# Altium project lab1.PrjPcb
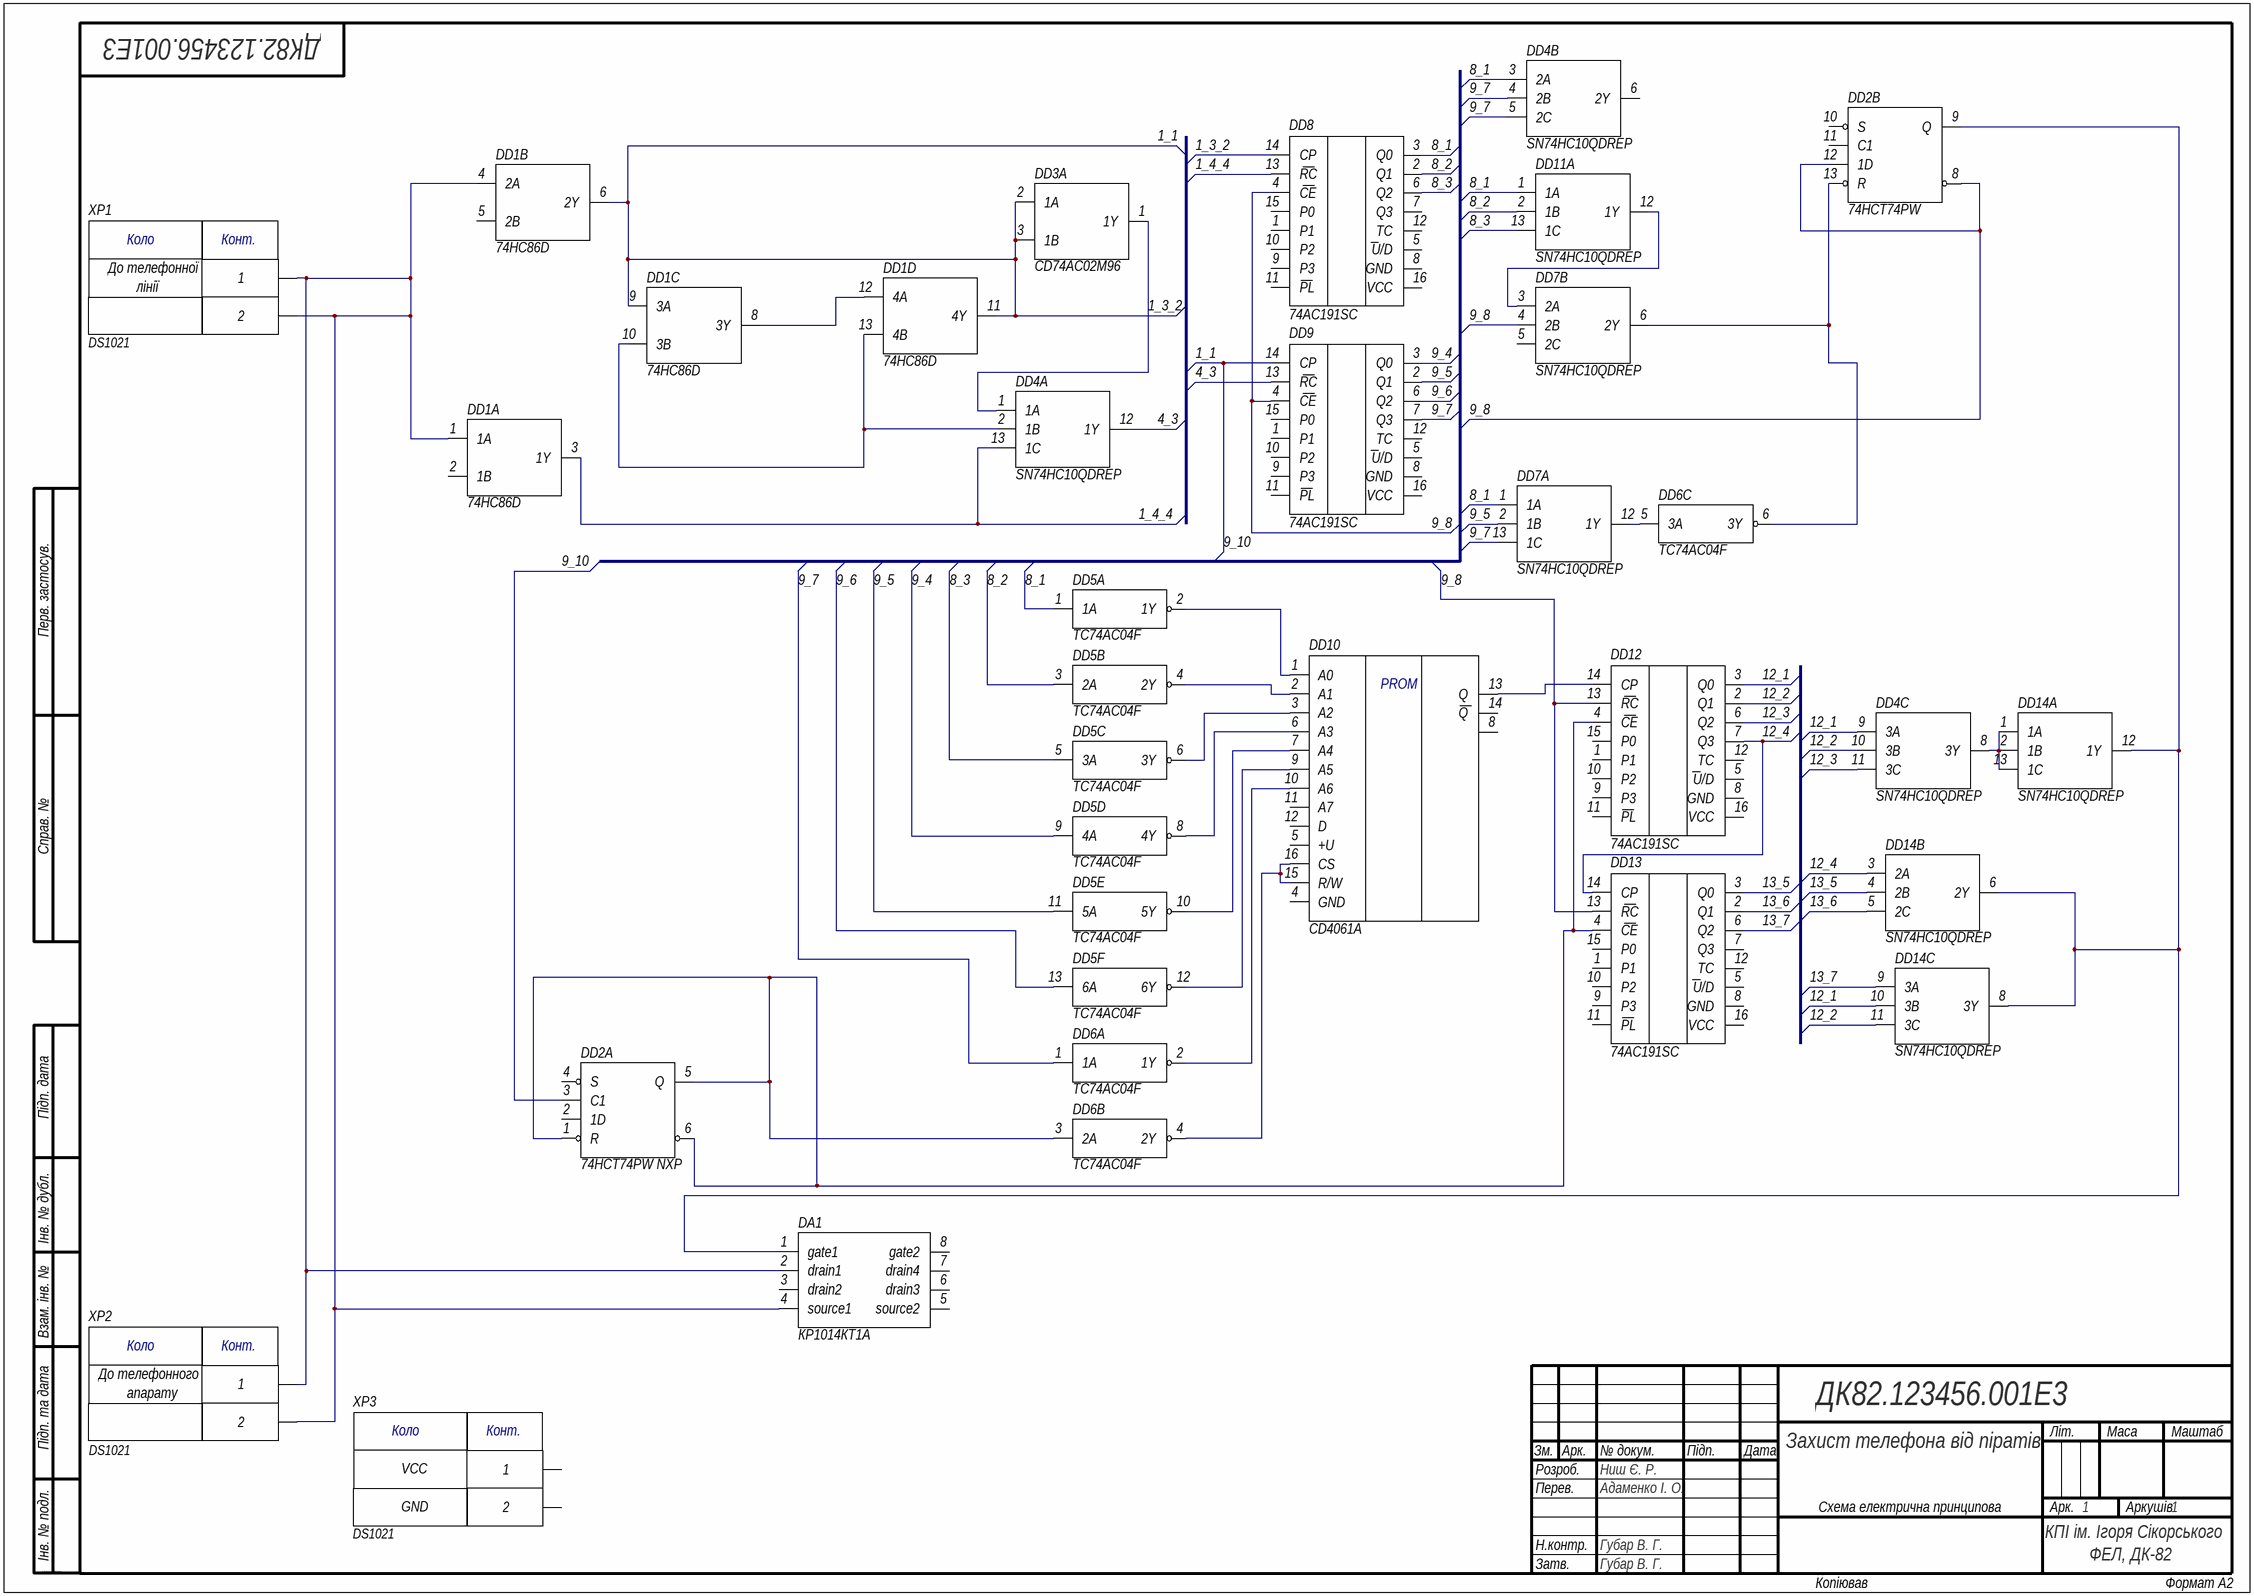
[diagram p0: s1mple.SchDoc]
Вид_документа_SCH: Схема електрична принципова; Код_документа_SCH: Э3; Наименование: Захист телефона від піратів; Наименование1: Захист телефона від піратів; Обозначение: ДК82.123456.001; Обозначение_Код: ДК82.123456.001Е3; Проект: ДК82.123456.001ЕЗ; Формат_PCB: А3; п_Н_контр_Р: Губар В. Г.; п_Пров_Р: Адаменко І. О.; п_Разраб_Р: Ниш Є. Р.; п_Утв_Р: Губар В. Г.
1 sheet, 18 parts. Net scope: global (net labels, ports and power ports of the same name join across sheets).
Board file: PCB1.PcbDoc

## Sheet s1mple.SchDoc
size 594 x 420 mm; Organization: ФЕЛ, ДК-82; DocumentNumber: 1; SheetNumber: 1; SheetTotal: 1

### Parts
DA1  КР1014КТ1А Электроника и связь  [DIP8]  (value not drawn)
DD1  74HC86D Philips  [SOIC-14]  (value not drawn)  (parts A,B,C,D of 5)
DD2  74HCT74PW NXP  [TSSOP-14]  (parts A,B of 3)
DD3  CD74AC02M96 TI  [SOIC-14]  (value not drawn)  (part A of 5)
DD4  SN74HC10QDREP Texas Instruments  [SOIC-14]  (value not drawn)  (parts A,B,C of 4)
DD5  TC74AC04F Toshiba  [SOIC-14]  (value not drawn)  (parts A,B,C,D,E,F of 7)
DD6  TC74AC04F Toshiba  [SOIC-14]  (value not drawn)  (parts A,B,C of 7)
DD7  SN74HC10QDREP Texas Instruments  [SOIC-14]  (value not drawn)  (parts A,B of 4)
DD8  74AC191SC Fairchild  [SOIC-16]  (value not drawn)
DD9  74AC191SC Fairchild  [SOIC-16]  (value not drawn)
DD10  CD4061A NXP  [DIP16]  (value not drawn)
DD11  SN74HC10QDREP Texas Instruments  [SOIC-14]  (value not drawn)  (part A of 4)
DD12  74AC191SC Fairchild  [SOIC-16]  (value not drawn)
DD13  74AC191SC Fairchild  [SOIC-16]  (value not drawn)
DD14  SN74HC10QDREP Texas Instruments  [SOIC-14]  (value not drawn)  (parts A,B,C of 4)
XP1  DS1021 Ningbo Zhenqin Electronic  [PLS-2]  (value not drawn)  (no BOM)
XP2  DS1021 Ningbo Zhenqin Electronic  [PLS-2]  (value not drawn)  (no BOM)
XP3  DS1021 Ningbo Zhenqin Electronic  [PLS-2]  (value not drawn)  (no BOM)

### Nets
1_1: DD1.6(2Y) DD1.9(3A) DD1.11(4Y) DD2.3(C1) DD3.1(1Y) DD3.2(1A) DD3.3(1B) DD4.1(1A) DD8.14(CP) DD9.14(CP)  [also labelled 1_3_2, 9_10]
1_4_4: DD1.3(1Y) DD4.13(1C) DD8.13(RC)
4_3: DD4.12(1Y) DD9.13(RC)
8_1: DD4.3(2A) DD5.1(1A) DD7.1(1A) DD8.3(Q0) DD11.1(1A)
8_2: DD5.3(2A) DD8.2(Q1) DD11.2(1B)
8_3: DD5.5(3A) DD8.6(Q2) DD11.13(1C)
9_4: DD5.9(4A) DD9.3(Q0)
9_5: DD5.11(5A) DD7.2(1B) DD9.2(Q1)
9_6: DD5.13(6A) DD9.6(Q2)
9_7: DD4.4(2B) DD4.5(2C) DD6.1(1A) DD7.13(1C) DD9.7(Q3)
9_8: DD2.8(Q) DD2.12(1D) DD7.4(2B) DD8.4(CE) DD9.4(CE) DD12.13(RC) DD13.13(RC)
12_1: DD4.9(3A) DD12.3(Q0) DD14.10(3B)
12_2: DD4.10(3B) DD12.2(Q1) DD14.11(3C)
12_3: DD4.11(3C) DD12.6(Q2)
12_4: DD12.7(Q3) DD13.14(CP) DD14.3(2A)
13_5: DD13.3(Q0) DD14.4(2B)
13_6: DD13.2(Q1) DD14.5(2C)
13_7: DD13.6(Q2) DD14.9(3A)
NetDA1_1: DA1.1(gate1) DD2.9(Q) DD14.6(2Y) DD14.8(3Y) DD14.12(1Y)
NetDA1_2: DA1.2(drain1) DA1.4(source1) DD1.1(1A) DD1.4(2A) XP1.1 XP1.2 XP2.1 XP2.2
NetDD1_8: DD1.8(3Y) DD1.12(4A)
NetDD1_10: DD1.10(3B) DD1.13(4B) DD4.2(1B)
NetDD2_1: DD2.1(R) DD2.5(Q) DD2.6(Q) DD6.3(2A) DD12.4(CE) DD13.4(CE)
NetDD2_13: DD2.13(R) DD6.6(3Y) DD7.6(2Y)
NetDD4_8: DD4.8(3Y) DD14.1(1A) DD14.2(1B) DD14.13(1C)
NetDD5_2: DD5.2(1Y) DD10.1(A0)
NetDD5_4: DD5.4(2Y) DD10.2(A1)
NetDD5_6: DD5.6(3Y) DD10.3(A2)
NetDD5_8: DD5.8(4Y) DD10.6(A3)
NetDD5_10: DD5.10(5Y) DD10.7(A4)
NetDD5_12: DD5.12(6Y) DD10.9(A5)
NetDD6_2: DD6.2(1Y) DD10.10(A6)
NetDD6_4: DD6.4(2Y) DD10.15(R/W) DD10.16(CS)
NetDD6_5: DD6.5(3A) DD7.12(1Y)
NetDD7_3: DD7.3(2A) DD11.12(1Y)
NetDD10_13: DD10.13(Q) DD12.14(CP)

Not connected (* = marked no-connect by the designer): DA1 3(drain2) 5(source2) 6(drain3) 7(drain4) 8(gate2); DD1 2(1B) 5(2B); DD2 2(1D) 4(S) 10(S) 11(C1); DD4 6(2Y); DD7 5(2C); DD8 1(P1) 5(U/D) 7(Q3) 8(GND) 9(P3) 10(P2) 11(PL) 12(TC) 15(P0) 16(VCC); DD9 1(P1) 5(U/D) 8(GND) 9(P3) 10(P2) 11(PL) 12(TC) 15(P0) 16(VCC); DD10 4(GND) 5(+U) 8 11(A7) 12(D) 14(Q); DD12 1(P1) 5(U/D) 8(GND) 9(P3) 10(P2) 11(PL) 12(TC) 15(P0) 16(VCC); DD13 1(P1) 5(U/D) 7(Q3) 8(GND) 9(P3) 10(P2) 11(PL) 12(TC) 15(P0) 16(VCC); XP3 1 2

### Notes on the sheet
- До телефонної
- лінії
- До телефонного
- апарату
- VCC
- GND
- Перв. застосув.
- Справ. №
- Підп. дата
- Інв. № дубл.
- Взам. інв. №
- Підп. та дата
- Зм.
- Розроб.
- Арк.
- № докум.
- Підп.
- Дата
- Літ.
- Маса
- Маштаб
- Перев.
- Аркушів
- Інв. № подл.
- Н.контр.
- Затв.
- КПІ ім. Ігоря Сікорського
- ALTIUM GOSTBOM2.0 KEV
- Копіював
- Формат А2
- (in symbol CD4061A) PROM
- (in symbol DS1021) Коло; Конт.

### Library data of the parts
DA1 = КР1014КТ1А: Name: КР1014КТ1А; Manufacturer: Электроника и связь
DD1 = 74HC86D: OR; Name: 74HC86D; Manufacturer: Philips
DD2 = 74HCT74PW: DUAL D FF POSEDG TRIG; Name: 74HCT74PW; Manufacturer: NXP
DD3 = CD74AC02M96: 2-INPUT NOR GATE; Name: CD74AC02M96; Manufacturer: TI
DD4 DD7 DD11 DD14 = SN74HC10QDREP: 3-INPUT NAND GATE; Name: SN74HC10QDREP; Manufacturer: Texas Instruments
DD5 DD6 = TC74AC04F: NOT; Name: TC74AC04F; Manufacturer: Toshiba
DD8 DD9 DD12 DD13 = 74AC191SC: Counter; Name: 74AC191SC; Manufacturer: Fairchild
DD10 = CD4061A: Name: CD4061A; Manufacturer: NXP
XP1-XP3 = DS1021: PLS-2_1x2; Manufacturer: Ningbo Zhenqin Electronic; Name: DS1021